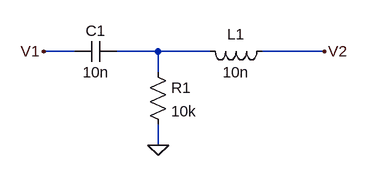
[diagram p0: schematic CircuitoTPrueba1.asc]
CircuitoTPrueba1.asc, the LTspice schematic file:
Version 4
SHEET 1 880 680
WIRE 80 112 32 112
WIRE 208 112 144 112
WIRE 288 112 208 112
WIRE 464 112 368 112
WIRE 208 144 208 112
WIRE 208 256 208 224
FLAG 32 112 V1
FLAG 464 112 V2
FLAG 208 256 0
SYMBOL res 192 128 R0
SYMATTR InstName R1
SYMATTR Value 10k
SYMBOL cap 144 96 R90
WINDOW 0 0 32 VBottom 2
WINDOW 3 32 32 VTop 2
SYMATTR InstName C1
SYMATTR Value 10n
SYMBOL ind 384 96 R90
WINDOW 0 5 56 VBottom 2
WINDOW 3 32 56 VTop 2
SYMATTR InstName L1
SYMATTR Value 10n

The netlist it stands for:
* CircuitoTPrueba1.asc
R1 N001 0 10k
C1 N001 V1 10n
L1 V2 N001 10n
.backanno
.end